# Altium schematic sheet raspi.SchDoc
size A
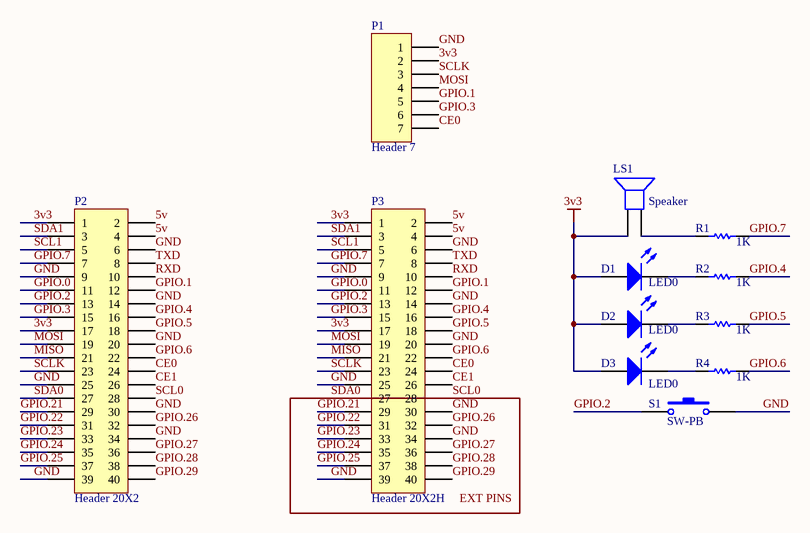
[diagram p0: raspi.SchDoc]

## Parts
D1  LED0  [LED-0]
D2  LED0  [LED-0]
D3  LED0  [LED-0]
LS1  Speaker  [PIN2]
P1  Header 7  [HDR1X7]
P2  Header 20X2  [HDR2X20]
P3  Header 20X2H  [HDR2X20H]
R1  value 1K  [AXIAL-0.3]  (hidden comment: Res1)
R2  value 1K  [AXIAL-0.3]  (hidden comment: Res1)
R3  value 1K  [AXIAL-0.3]  (hidden comment: Res1)
R4  value 1K  [AXIAL-0.3]  (hidden comment: Res1)
S1  SW-PB  [SPST-2]

## Nets
3v3: D1.1(A) D2.1(A) D3.1(A) LS1.1 P1.2 P2.1 P2.17 P3.1 P3.17
5v: P2.2 P2.4 P3.2 P3.4
CE0: P1.7 P2.24 P3.24
CE1: P2.26 P3.26
GND: P1.1 P2.6 P2.9 P2.14 P2.20 P2.25 P2.30 P2.34 P2.39 P3.6 P3.9 P3.14 P3.20 P3.25 P3.30 P3.34 P3.39 S1.2
GPIO.0: P2.11 P3.11
GPIO.1: P1.5 P2.12 P3.12
GPIO.2: P2.13 P3.13 S1.1
GPIO.3: P1.6 P2.15 P3.15
GPIO.4: P2.16 P3.16 R2.2
GPIO.5: P2.18 P3.18 R3.2
GPIO.6: P2.22 P3.22 R4.2
GPIO.7: P2.7 P3.7 R1.2
GPIO.21: P2.29 P3.29
GPIO.22: P2.31 P3.31
GPIO.23: P2.33 P3.33
GPIO.24: P2.35 P3.35
GPIO.25: P2.37 P3.37
GPIO.26: P2.32 P3.32
GPIO.27: P2.36 P3.36
GPIO.28: P2.38 P3.38
GPIO.29: P2.40 P3.40
MISO: P2.21 P3.21
MOSI: P1.4 P2.19 P3.19
RXD: P2.10 P3.10
SCL0: P2.28 P3.28
SCL1: P2.5 P3.5
SCLK: P1.3 P2.23 P3.23
SDA0: P2.27 P3.27
SDA1: P2.3 P3.3
TXD: P2.8 P3.8
NetD1_2: D1.2(K) R2.1
NetD2_2: D2.2(K) R3.1
NetD3_2: D3.2(K) R4.1
NetLS1_2: LS1.2 R1.1

## Notes on the sheet
- (near P3) EXT PINS

## Library data of the parts
D1-D3 = LED0: Typical INFRARED GaAs LED; Published: 8-Jun-2000; LatestRevisionDate: 08-Jul-2005; LatestRevisionNote: Mech Layer 1 removed.; PackageReference: LED-0; Publisher: Altium Limited; PackageDescription: LED; 2 Leads
LS1 = Speaker: Loudspeaker; Published: 24-Mar-1999; LatestRevisionDate: 17-Jul-2002; LatestRevisionNote: Re-released for DXP Platform.; PackageReference: PIN2; Publisher: Altium Limited
P1 = Header 7: Header, 7-Pin; LatestRevisionDate: 17-Jul-2002; LatestRevisionNote: Re-released for DXP Platform.; Publisher: Altium Limited
P2 = Header 20X2: Header, 20-Pin, Dual row; LatestRevisionDate: 17-Jul-2002; LatestRevisionNote: Re-released for DXP Platform.; Publisher: Altium Limited
P3 = Header 20X2H: Header, 20-Pin, Dual row, Right Angle; LatestRevisionDate: 17-Jul-2002; LatestRevisionNote: Re-released for DXP Platform.; Publisher: Altium Limited
R1-R4 = Res1: Resistor; Published: 8-Jun-2000; LatestRevisionDate: 17-Jul-2002; LatestRevisionNote: Re-released for DXP Platform.; PackageReference: AXIAL-0.3; Publisher: Altium Limited; PackageDescription: Axial Device, Thru-Hole; 2 Leads; 0.3 in Pin Spacing
S1 = SW-PB: Switch; Published: 24-Mar-1999; LatestRevisionDate: 17-Jul-2002; LatestRevisionNote: Re-released for DXP Platform.; PackageReference: SPST-2; Publisher: Altium Limited; PackageDescription: Switch; 2 Leads